# EAGLE design Wio_MB128_Test_rev_B (EAGLE 9.6.2)
PC Engine Joypad Breakout Version 1.0
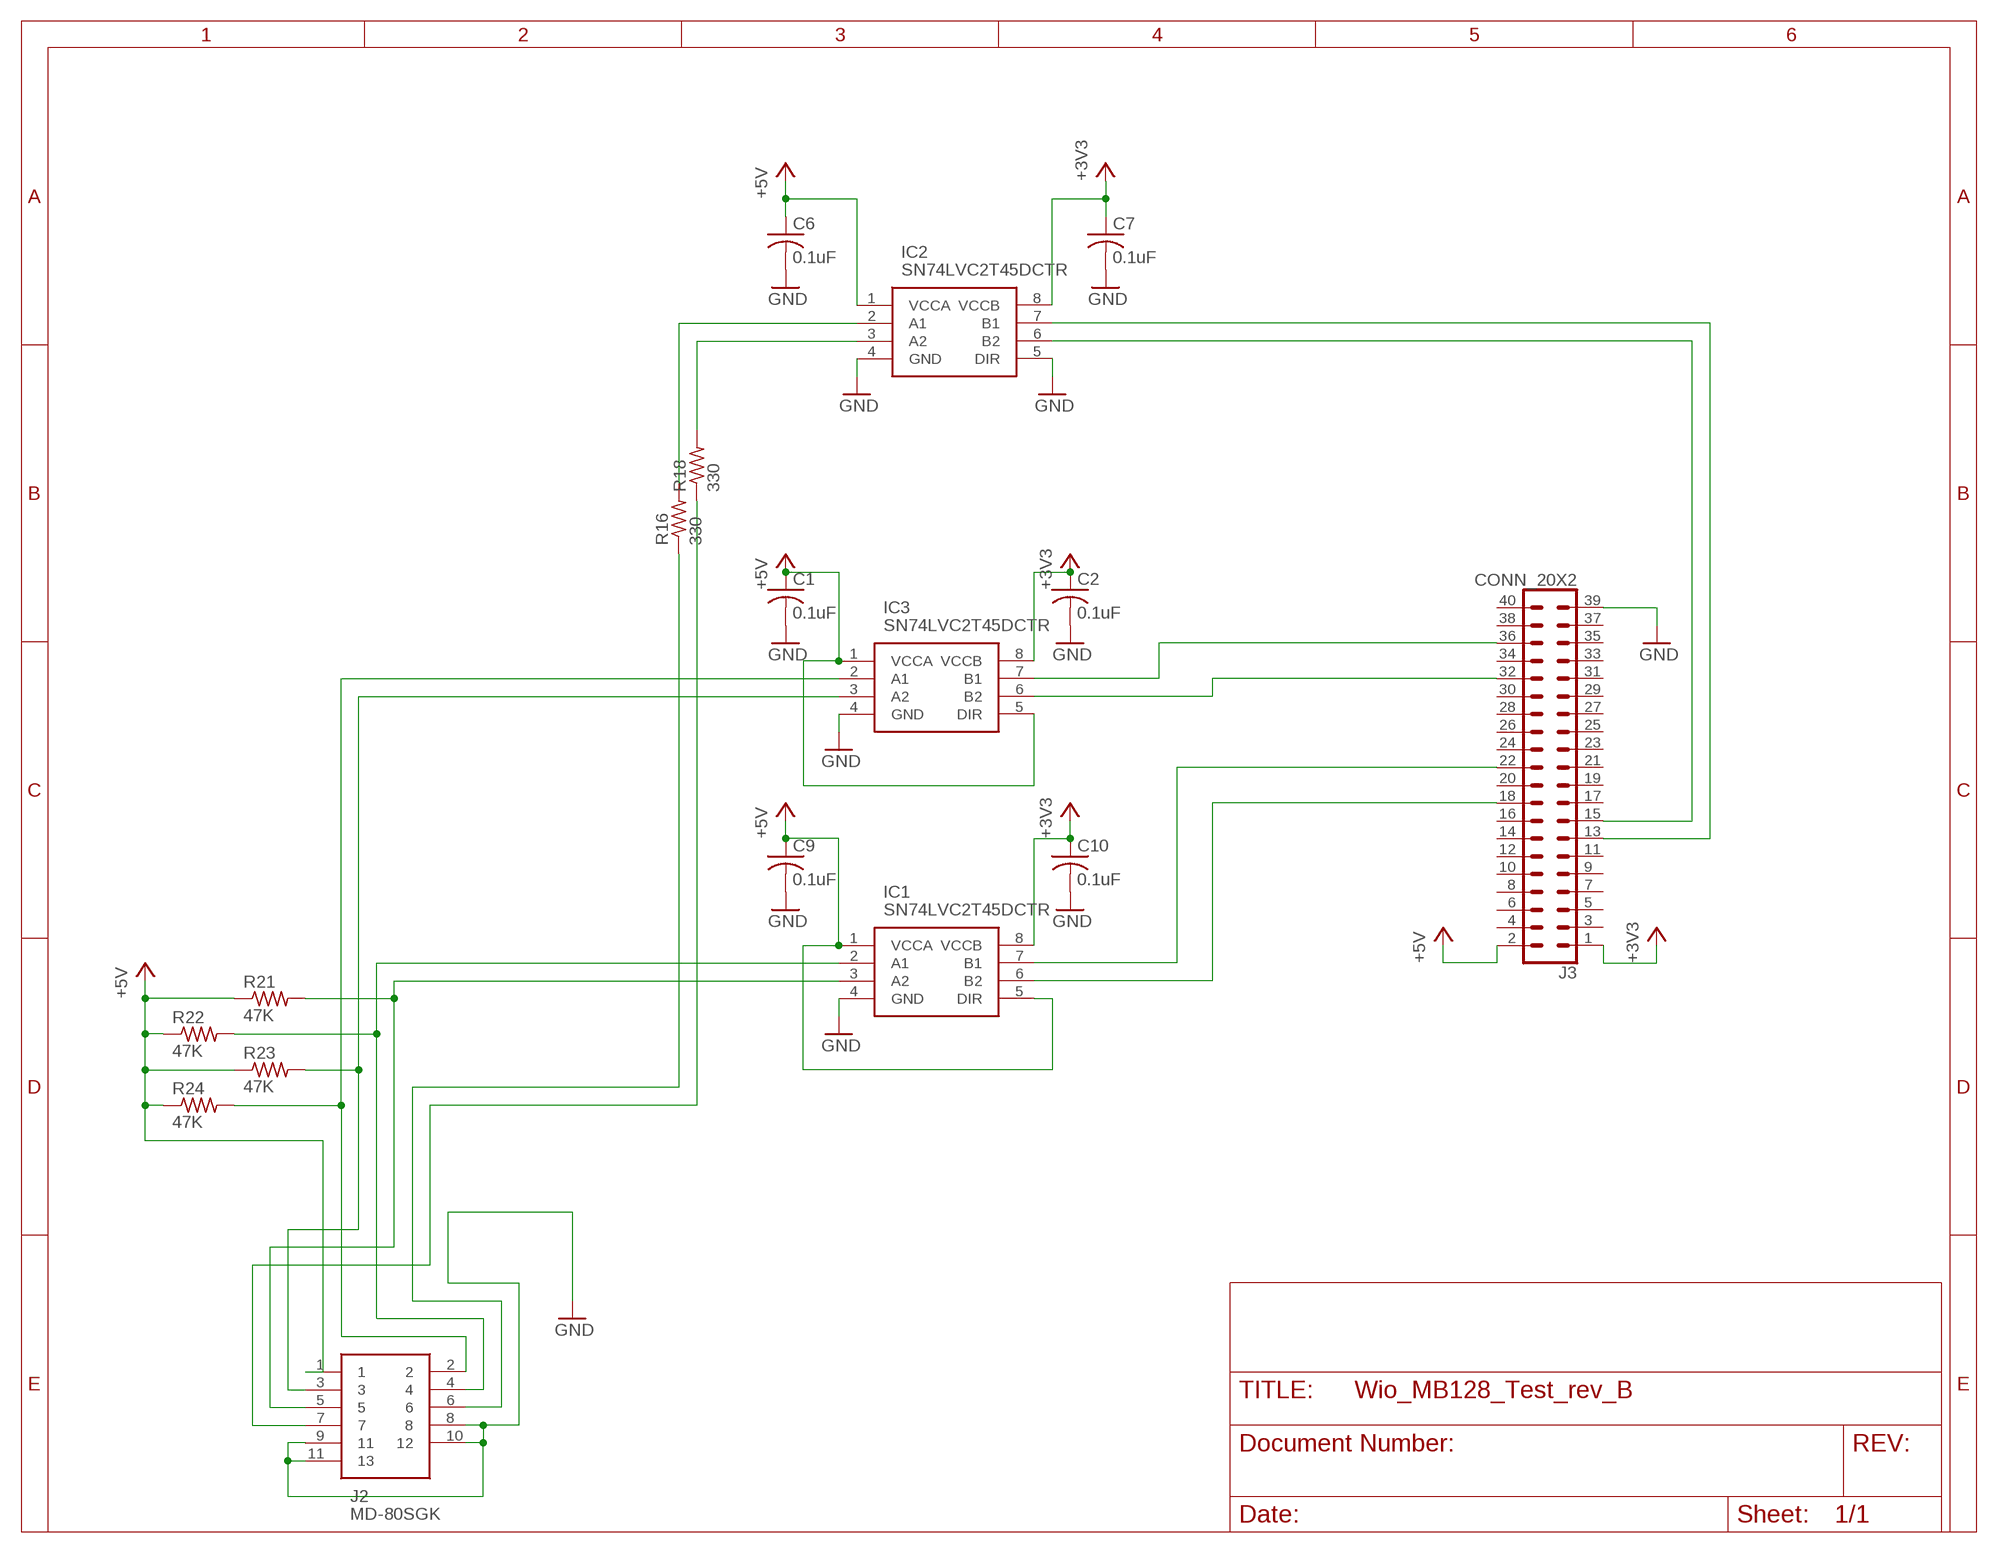
[diagram p0: schematic, sheet 1]

## Parts
C1  0.1uF  C-USC0603  [C0603]
C2  0.1uF  C-USC0603  [C0603]
C6  0.1uF  C-USC0603  [C0603]
C7  0.1uF  C-USC0603  [C0603]
C9  0.1uF  C-USC0603  [C0603]
C10  0.1uF  C-USC0603  [C0603]
IC1  SN74LVC2T45DCTR  [SOP65P400X130-8N]
IC2  SN74LVC2T45DCTR  [SOP65P400X130-8N]
IC3  SN74LVC2T45DCTR  [SOP65P400X130-8N]
J2  MD-80SGK  [MD80SGK]
J3  CONN_20X2  [2X20]
R16  330  R-US_R0603  [R0603]
R18  330  R-US_R0603  [R0603]
R21  47K  R-US_R0603  [R0603]
R22  47K  R-US_R0603  [R0603]
R23  47K  R-US_R0603  [R0603]
R24  47K  R-US_R0603  [R0603]

## Nets
+3V3 [power]: C2.1 C7.1 C10.1 IC1.8(VCCB) IC2.8(VCCB) IC3.8(VCCB) J3.1
+5V [power]: C1.1 C6.1 C9.1 IC1.1(VCCA) IC1.5(DIR) IC2.1(VCCA) IC3.1(VCCA) IC3.5(DIR) J2.1 J3.2 R21.1 R22.1 R23.1 R24.1
CLR [signal]: J2.7 R18.1
D11 [signal]: IC1.7(B1) J3.22
GND: C1.2 C2.2 C6.2 C7.2 C9.2 C10.2 IC1.4(GND) IC2.4(GND) IC2.5(DIR) IC3.4(GND) J2.8 J2.9 J2.10 J2.11 J3.39
N$1: IC2.7(B1) J3.13
N$2 [signal]: IC3.3(A2) J2.3 R23.2
N$3 [signal]: IC3.2(A1) J2.2 R24.2
N$4: IC2.6(B2) J3.15
N$8: IC1.6(B2) J3.18
N$13 [signal]: IC2.2(A1) R16.2
N$16: IC1.2(A1) J2.4 R22.2
N$18: IC1.3(A2) J2.5 R21.2
N$21 [signal]: IC2.3(A2) R18.2
N$33: IC3.7(B1) J3.36
N$34: IC3.6(B2) J3.32
SEL [signal]: J2.6 R16.1
Unconnected: J3.3 J3.4 J3.5 J3.6 J3.7 J3.8 J3.9 J3.10 J3.11 J3.12 J3.14 J3.16 J3.17 J3.19 J3.20 J3.21 J3.23 J3.24 J3.25 J3.26 J3.27 J3.28 J3.29 J3.30 J3.31 J3.33 J3.34 J3.35 J3.37 J3.38 J3.40

## Library data of the parts
C1 C2 C6 C7 C9 C10 = resistor:C-US: CAPACITOR, American symbol
IC1-IC3 = SamacSys_Parts:SN74LVC2T45DCTR: 2-Bit Bus Transceiver, Translation SSOP8 SN74LVC2T45DCTR, Voltage Level Translator, Bus Transceiver LVC, 3-State 1.65 Source: Datasheet <http://www.ti.com/lit/ds/symlink/sn74lvc2t45.pdf>; DESCRIPTION: 2-Bit Bus Transceiver, Translation SSOP8 SN74LVC2T45DCTR, Voltage Level Translator, Bus Transceiver LVC, 3-State 1.65; HEIGHT: 1.3mm; MANUFACTURER_NAME: Texas Instruments; MANUFACTURER_PART_NUMBER: SN74LVC2T45DCTR; MOUSER_PART_NUMBER: 595-SN74LVC2T45DCTR; MOUSER_PRICE-STOCK: https://www.mouser.com/Search/Refine.aspx?Keyword=595-SN74LVC2T45DCTR; RS_PART_NUMBER: 9213022; RS_PRICE-STOCK: http://uk.rs-online.com/web/p/products/9213022
J2 = SamacSys_Parts:MD-80SGK: Circular DIN Connectors mini-DIN, 8P jack, rt, through hole, full shield Source: Datasheet <https://www.cui.com/product/resource/md-sgk-series.pdf>; DESCRIPTION: Circular DIN Connectors mini-DIN, 8P jack, rt, through hole, full shield; HEIGHT: 13mm; MANUFACTURER_NAME: CUI; MANUFACTURER_PART_NUMBER: MD-80SGK; MOUSER_PART_NUMBER: 490-MD-80SGK; MOUSER_PRICE-STOCK: https://www.mouser.com/Search/Refine.aspx?Keyword=490-MD-80SGK
J3 = SparkFun-Connectors:CONN_20X2: Multi connection point. Often used as Generic Header-pin footprint for 0.1 inch spaced/style header connections On any of the 0.1 inch spaced packages, you can populate with these: Break Away Headers - Straight <https://www.sparkfun.com/products/116> (PRT-00116) Break Away Male Headers - Right Angle <https://www.sparkfun.com/products/553> (PRT-00553) Female Headers <https://www.sparkfun.com/products/115> (PRT-00115) Break Away Headers - Machine Pin <https://www.sparkfun.com/products/117> (PRT-00117) Break Away Female Headers - Swiss Machine Pin <https://www.sparkfun.com/products/743> (PRT-00743)
R16 R18 R21-R24 = resistor:R-US_: RESISTOR, American symbol

## Net classes
0 default: width 0.152 mm, drill 0.356 mm, clearance 0.152 mm
1 power: width 0.305 mm, drill 0.356 mm, clearance 0.152 mm
2 signal: width 0.152 mm, drill 0.356 mm, clearance 0.152 mm

## Board
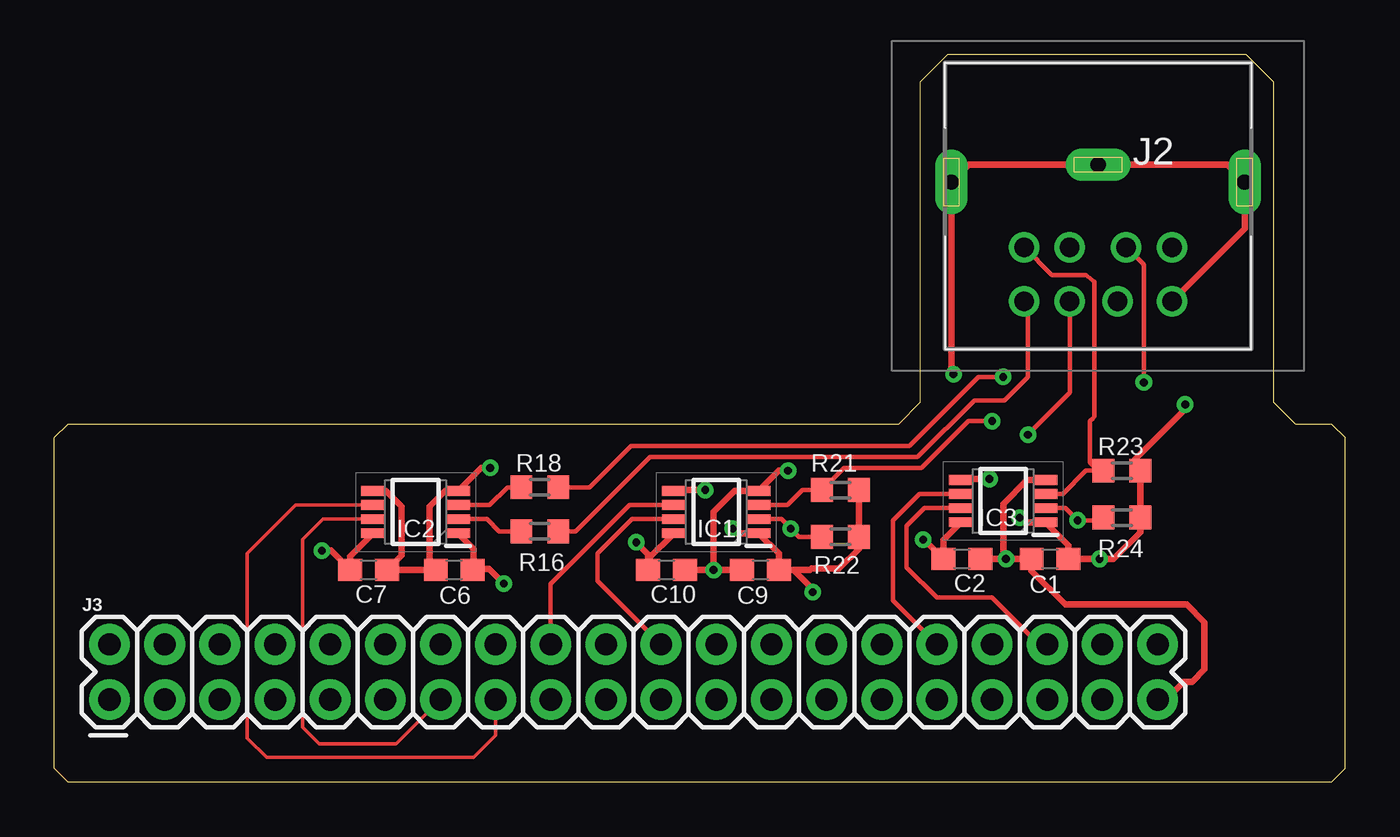
[diagram p1: board, top side]
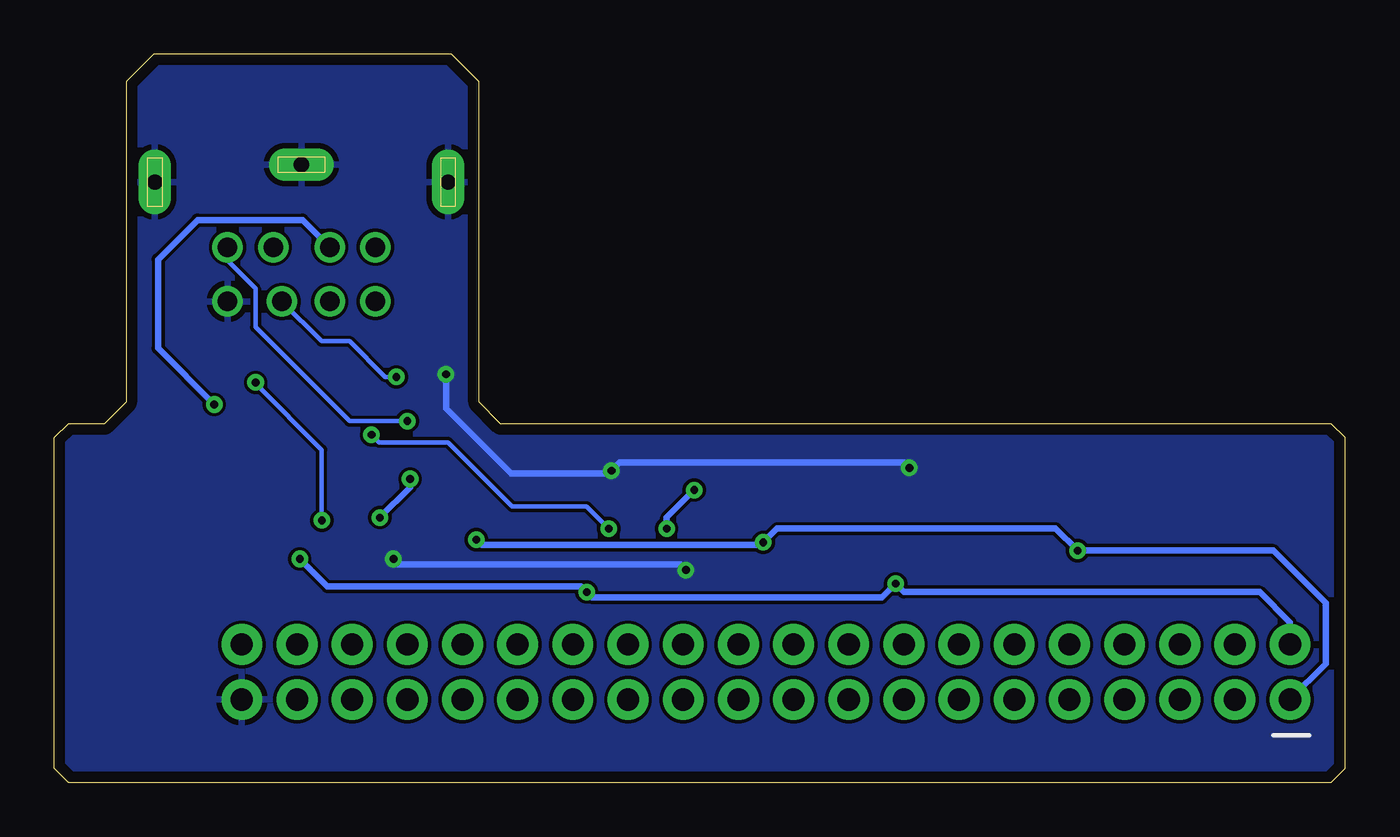
[diagram p2: board, bottom side, seen from below]

Size 59.44 x 33.53 mm. Coordinates in mm from the lower left corner, seen from the top.
Outline: 57.13,16.51 58.8,16.51 59.44,15.88 59.44,0.64 58.8,0 0.64,0 0,0.64 0,15.88 0.64,16.51 38.88,16.51 39.88,17.51 39.88,32.26 41.15,33.53 54.86,33.53 56.13,32.26 56.13,17.51 57.13,16.51
Copper layers (1*16): Top 0.035mm / dielectric 1.5mm / Bottom 0.035mm
Design rules "default *": minimum track width 6mil, minimum drill 0.35mm, track to track 6mil, track to pad 6mil, pad to pad 6mil, via to via 6mil, smd to smd 6mil, copper to edge 20mil, drill to drill 6mil, minimum pad ring 10mil, minimum via ring 8mil, stop-mask expansion 3mil, vias tented up to drill 20mil, thermal gap 10mil

### Footprints (pad centres in the part's own frame; a part is rotated, then mirrored left to right if it is on the bottom)
C0603 = smd 1.1 x 1: 1 -0.85,0; 2 0.85,0
SOP65P400X130-8N = smd 1.1 x 0.45: 1 -1.95,0.975; 2 -1.95,0.325; 3 -1.95,-0.325; 4 -1.95,-0.975; 5 1.95,-0.975; 6 1.95,-0.325; 7 1.95,0.325; 8 1.95,0.975
MD80SGK = drill 0.9 pad 1.4: 1 -1.3,-1.9; 2 1.3,-1.9; 3 -3.4,-1.9; 4 -1.3,-4.4; 5 3.4,-1.9; 6 -3.4,-4.4; 7 0.9,-4.4; 8 3.4,-4.4 | drill 0.7 pad 1.5 long: 9 0,1.9; 10 -6.75,1.1; 11 6.75,1.1
2X20 = drill 1.016 pad 1.88: 1 0,0; 2 0,2.54; 3 2.54,0; 4 2.54,2.54; 5 5.08,0; 6 5.08,2.54; 7 7.62,0; 8 7.62,2.54; 9 10.16,0; 10 10.16,2.54; 11 12.7,0; 12 12.7,2.54; 13 15.24,0; 14 15.24,2.54; 15 17.78,0; 16 17.78,2.54; 17 20.32,0; 18 20.32,2.54; 19 22.86,0; 20 22.86,2.54; 21 25.4,0; 22 25.4,2.54; 23 27.94,0; 24 27.94,2.54; 25 30.48,0; 26 30.48,2.54; 27 33.02,0; 28 33.02,2.54; 29 35.56,0; 30 35.56,2.54; 31 38.1,0; 32 38.1,2.54; 33 40.64,0; 34 40.64,2.54; 35 43.18,0; 36 43.18,2.54; 37 45.72,0; 38 45.72,2.54; 39 48.26,0; 40 48.26,2.54
R0603 = smd 1 x 1.1: 1 -0.85,0; 2 0.85,0

### Placement (x,y rotation side)
C1  45.85,10.29 180 top
C2  41.78,10.29 0 top
C6  18.41,9.78 180 top
C7  14.48,9.78 0 top
C9  32.51,9.78 180 top
C10  28.19,9.78 0 top
IC1  30.48,12.45 180 top
IC2  16.64,12.45 180 top
IC3  43.69,12.95 180 top
J2  48.06,26.54 0 top
J3  2.54,3.81 0 top
R16  22.35,11.56 180 top
R18  22.35,13.59 180 top
R21  36.2,13.46 180 top
R22  36.2,11.3 180 top
R23  49.15,14.35 180 top
R24  49.15,12.19 180 top

### Tracks (layer width: path | path; a pad name or v marks a point on that pad's centre or on a via)
+3V3  (via drill 0.36)
  Top 0.305: IC1.8 27.34,10.29 C10.1 27.34,10.5 v26.8,11.05 | IC3.8 40.93,11.17 C2.1 40.04,11.18 v40.01,11.18 | IC2.8 13.63,10.41 C7.1 12.74,10.67 v12.32,10.67
  Bottom 0.305: J3.1 0.89,5.46 0.89,8.26 3.3,10.67 v12.32,10.67 13.34,11.68 26.16,11.68 v26.8,11.05 26.92,11.05 27.05,10.92 39.75,10.92 v40.01,11.18
+5V  (via drill 0.36)
  Top 0.305: C1.1 46.7,10.92 IC3.1 44.66,11.98 v44.45,12.19 | C9.1 33.36,10.54 IC1.1 31.45,11.47 v31.24,11.68 | IC2.1 19.3,10.75 19.3,9.82 | 19.3,9.82 C6.1 | C9.1 34.8,9.78 34.86,9.84 36.13,9.84 37.05,10.76 R22.1 R21.1 | v20.7,9.14 20.03,9.82 19.3,9.82 | C1.1 v48.13,10.29 | v34.92,8.76 34.92,8.89 34.04,9.78 C9.1 | C1.1 48.77,10.29 50,11.52 R24.1 R23.1 49.74,14.61 49.74,14.86 52.07,17.18 v52.07,17.4 | IC3.5 41.78,13.97 v43.05,13.97 | v29.97,13.46 28.57,13.46 IC1.5
  Bottom 0.305: J2.1 48.01,25.9 52.84,25.9 54.66,24.08 54.66,19.99 v52.07,17.4 | J3.2 2.54,7.37 3.94,8.76 20.32,8.76 v20.7,9.14 21.34,8.51 34.67,8.51 v34.92,8.76 35.18,9.02 46.86,9.02 v48.13,10.29 | v44.45,12.19 43.05,13.59 v43.05,13.97 | v31.24,11.68 31.24,12.19 v29.97,13.46
CLR  (via drill 0.36)
  Top 0.203: R18.1 24.64,13.59 26.54,15.49 39.37,15.49 42.55,18.67 v43.69,18.67
  Bottom 0.203: J2.7 47.13,20.32 45.85,20.32 44.2,18.67 v43.69,18.67
D11
  Top 0.203: IC1.7 26.6,12.12 25.02,10.54 25.02,9.27 J3.22
GND  (via drill 0.36)
  Top 0.305: J2.8 54.81,25.49 J2.11 54.01,28.44 J2.9 42.11,28.44 J2.10 41.31,18.89 v41.4,18.8 | IC3.4 44.79,13.93 43.69,12.83 43.69,10.41 v43.81,10.29 | v20.07,14.48 19.64,14.48 IC2.4 17.99,13.42 17.27,12.7 17.27,10.07 C6.2 C7.2 16,10.45 16,12.7 15.28,13.42 IC2.5 | v33.78,14.35 33.36,14.35 IC1.4 31.33,13.42 30.35,12.45 v30.35,9.78 | J3.39 51.18,3.81 52.01,4.64 52.39,4.64 52.96,5.21 52.96,7.37 52.13,8.19 46.55,8.19 45,9.74 C1.2 v43.81,10.29 | v43.81,10.29 C2.2 | v30.35,9.78 C9.2 | v30.35,9.78 C10.2
  Bottom 0.305: v20.07,14.48 20.32,14.73 33.4,14.73 v33.78,14.35 33.91,14.22 38.41,14.22 41.4,17.22 v41.4,18.8 | v43.81,10.29 43.81,10.03 30.61,10.03 v30.35,9.78
  pour Bottom: -0.51,-0.51 -0.51,33.78 59.94,33.78 59.94,-0.51
N$1
  Top 0.152: J3.13 15.75,1.78 12.19,1.78 11.43,2.54 11.43,11.18 12.38,12.12 IC2.7
N$2
  Top 0.203: J2.3 45.93,23.37 47.5,23.37 47.88,23.06 47.88,16.84 47.81,16.76 47.68,16.63 47.68,14.72 48.05,14.35 R23.2 47.5,14.35 46.43,13.28 IC3.3
N$3  (via drill 0.36)
  Top 0.203: J2.2 50.16,23.84 v50.16,18.41 | IC3.2 46.55,12.63 v47.12,12.06 48.17,12.06 R24.2
  Bottom 0.203: v47.12,12.06 47.12,15.32 50.16,18.36 v50.16,18.41
N$4
  Top 0.152: J3.15 20.32,2.16 19.3,1.14 9.78,1.14 8.89,2.03 8.89,10.54 11.12,12.77 IC2.6
N$8
  Top 0.203: J3.18 22.86,9.14 26.49,12.77 IC1.6
N$13
  Top 0.203: IC2.2 19.92,12.12 20.49,11.56 R16.2
N$16  (via drill 0.36)
  Top 0.203: J2.4 46.76,17.95 44.83,16.03 v44.83,16 | IC1.2 33.47,12.12 v33.91,11.68 34.29,11.3 R22.2
  Bottom 0.203: v33.91,11.68 34.92,12.7 38.35,12.7 41.31,15.66 44.49,15.66 v44.83,16
N$18  (via drill 0.36)
  Top 0.203: IC1.3 33.77,12.77 34.46,13.46 R21.2 36.36,14.48 39.92,14.48 42.08,16.64 v43.18,16.64
  Bottom 0.203: J2.5 51.46,24.02 50.16,22.73 50.16,20.95 45.85,16.64 v43.18,16.64
N$21
  Top 0.203: IC2.3 20.05,12.77 20.87,13.59 R18.2
N$33
  Top 0.203: J3.36 45.34,6.35 43.18,8.51 40.64,8.51 39.24,9.91 39.24,11.81 40.06,12.63 IC3.7
N$34
  Top 0.203: J3.32 38.61,8.38 38.61,12.06 39.82,13.28 IC3.6
SEL
  Top 0.203: R16.1 24,11.56 27.43,14.99 39.75,14.99 42.35,17.59 43.75,17.59 44.82,18.66 44.82,21.98 J2.6

### Text on the board
bValues: Mem128 Wio, rev. A | (C)2021 David Shadoff